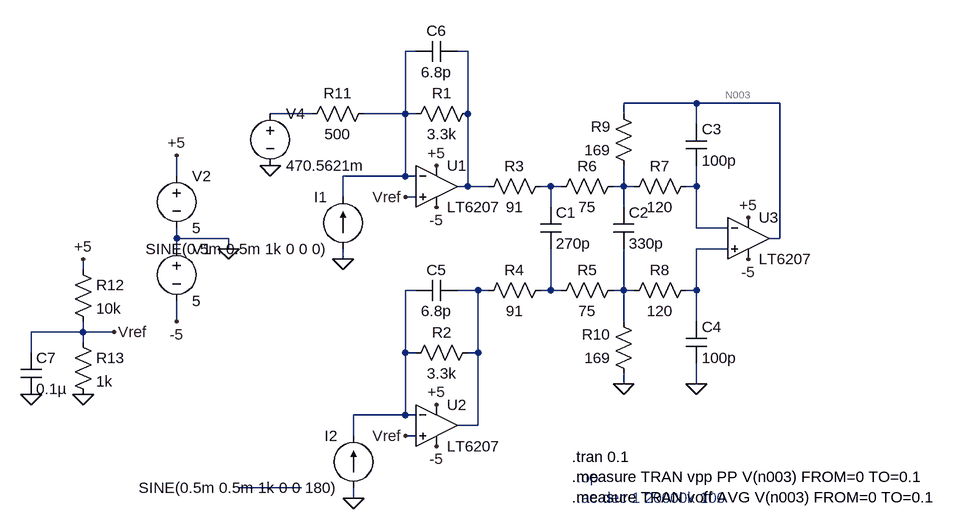
[diagram p0: schematic tsunami output stage.asc]
tsunami output stage.asc, the LTspice schematic file:
Version 4
SHEET 1 904 732
WIRE 112 16 96 16
WIRE 192 16 176 16
WIRE 544 96 432 96
WIRE 672 96 544 96
WIRE -48 112 -112 112
WIRE 96 112 96 16
WIRE 96 112 32 112
WIRE 112 112 96 112
WIRE 192 112 192 16
WIRE 432 112 432 96
WIRE 544 128 544 96
WIRE -256 208 -256 176
WIRE 96 208 96 112
WIRE 96 208 0 208
WIRE 112 208 96 208
WIRE 192 224 192 112
WIRE 192 224 176 224
WIRE 224 224 192 224
WIRE 320 224 304 224
WIRE 336 224 320 224
WIRE 432 224 432 192
WIRE 432 224 416 224
WIRE 448 224 432 224
WIRE 544 224 544 192
WIRE 544 224 528 224
WIRE 0 240 0 208
WIRE 112 240 96 240
WIRE 320 256 320 224
WIRE 432 256 432 224
WIRE 544 288 544 224
WIRE 592 288 544 288
WIRE -256 304 -256 288
WIRE -176 304 -256 304
WIRE 672 304 672 96
WIRE 672 304 656 304
WIRE -256 320 -256 304
WIRE -176 320 -176 304
WIRE 592 320 544 320
WIRE 0 336 0 320
WIRE -400 352 -400 336
WIRE 112 384 96 384
WIRE 208 384 176 384
WIRE 224 384 208 384
WIRE 320 384 320 320
WIRE 320 384 304 384
WIRE 336 384 320 384
WIRE 432 384 432 320
WIRE 432 384 416 384
WIRE 448 384 432 384
WIRE 544 384 544 320
WIRE 544 384 528 384
WIRE -256 432 -256 400
WIRE 432 432 432 384
WIRE 544 432 544 384
WIRE -400 448 -400 432
WIRE -400 448 -480 448
WIRE -352 448 -400 448
WIRE -400 464 -400 448
WIRE -480 480 -480 448
WIRE 96 480 96 384
WIRE 112 480 96 480
WIRE 208 480 208 384
WIRE 208 480 192 480
WIRE 432 528 432 512
WIRE 544 528 544 496
WIRE 96 576 96 480
WIRE 96 576 16 576
WIRE 112 576 96 576
WIRE 208 592 208 480
WIRE 208 592 176 592
WIRE 16 608 16 576
WIRE 112 608 96 608
WIRE -64 688 -160 688
WIRE 16 704 16 688
FLAG -256 176 +5
FLAG -256 432 -5
FLAG -176 320 0
FLAG 144 192 +5
FLAG 144 560 +5
FLAG 624 272 +5
FLAG 144 256 -5
FLAG 144 624 -5
FLAG 624 336 -5
FLAG 432 528 0
FLAG 544 528 0
FLAG 0 336 0
FLAG 16 704 0
FLAG -352 448 Vref
FLAG -400 544 0
FLAG 96 240 Vref
FLAG 96 608 Vref
FLAG -112 192 0
FLAG -400 336 +5
FLAG -480 544 0
SYMBOL voltage -256 304 R0
SYMATTR InstName V1
SYMATTR Value 5
SYMBOL voltage -256 192 R0
SYMATTR InstName V2
SYMATTR Value 5
SYMBOL Opamps/LT6207 144 224 R0
SYMATTR InstName U1
SYMBOL Opamps/LT6207 144 592 R0
SYMATTR InstName U2
SYMBOL Opamps/LT6207 624 304 R0
SYMATTR InstName U3
SYMBOL res 208 96 R90
WINDOW 0 0 56 VBottom 2
WINDOW 3 32 56 VTop 2
SYMATTR InstName R1
SYMATTR Value 3.3k
SYMBOL res 208 464 R90
WINDOW 0 0 56 VBottom 2
WINDOW 3 32 56 VTop 2
SYMATTR InstName R2
SYMATTR Value 3.3k
SYMBOL res 320 208 R90
WINDOW 0 0 56 VBottom 2
WINDOW 3 32 56 VTop 2
SYMATTR InstName R3
SYMATTR Value 91
SYMBOL res 320 368 R90
WINDOW 0 0 56 VBottom 2
WINDOW 3 32 56 VTop 2
SYMATTR InstName R4
SYMATTR Value 91
SYMBOL res 432 368 R90
WINDOW 0 0 56 VBottom 2
WINDOW 3 32 56 VTop 2
SYMATTR InstName R5
SYMATTR Value 75
SYMBOL res 432 208 R90
WINDOW 0 0 56 VBottom 2
WINDOW 3 32 56 VTop 2
SYMATTR InstName R6
SYMATTR Value 75
SYMBOL res 544 208 R90
WINDOW 0 0 56 VBottom 2
WINDOW 3 32 56 VTop 2
SYMATTR InstName R7
SYMATTR Value 120
SYMBOL res 544 368 R90
WINDOW 0 0 56 VBottom 2
WINDOW 3 32 56 VTop 2
SYMATTR InstName R8
SYMATTR Value 120
SYMBOL res 448 208 R180
WINDOW 0 36 76 Left 2
WINDOW 3 36 40 Left 2
SYMATTR InstName R9
SYMATTR Value 169
SYMBOL res 448 528 R180
WINDOW 0 36 76 Left 2
WINDOW 3 36 40 Left 2
SYMATTR InstName R10
SYMATTR Value 169
SYMBOL cap 304 256 R0
SYMATTR InstName C1
SYMATTR Value 270p
SYMBOL cap 416 256 R0
SYMATTR InstName C2
SYMATTR Value 330p
SYMBOL cap 528 128 R0
SYMATTR InstName C3
SYMATTR Value 100p
SYMBOL cap 528 432 R0
SYMATTR InstName C4
SYMATTR Value 100p
SYMBOL cap 176 368 R90
WINDOW 0 0 32 VBottom 2
WINDOW 3 32 32 VTop 2
SYMATTR InstName C5
SYMATTR Value 6.8p
SYMBOL cap 176 0 R90
WINDOW 0 0 32 VBottom 2
WINDOW 3 32 32 VTop 2
SYMATTR InstName C6
SYMATTR Value 6.8p
SYMBOL current 0 320 R180
WINDOW 0 24 80 Left 2
WINDOW 3 24 0 Left 2
SYMATTR InstName I1
SYMATTR Value SINE(0.5m 0.5m 1k 0 0 0)
SYMATTR Value2 AC 2m 0
SYMBOL current 16 688 R180
WINDOW 0 24 80 Left 2
WINDOW 3 24 0 Left 2
SYMATTR InstName I2
SYMATTR Value SINE(0.5m 0.5m 1k 0 0 180)
SYMATTR Value2 AC 2m 180
SYMBOL res -416 336 R0
SYMATTR InstName R12
SYMATTR Value 10k
SYMBOL res -416 448 R0
SYMATTR InstName R13
SYMATTR Value 1k
SYMBOL res 48 96 R90
WINDOW 0 0 56 VBottom 2
WINDOW 3 32 56 VTop 2
SYMATTR InstName R11
SYMATTR Value 500
SYMBOL voltage -112 96 R0
SYMATTR InstName V4
SYMATTR Value 470.5621m
SYMBOL cap -496 480 R0
SYMATTR InstName C7
SYMATTR Value 0.1µ
TEXT 360 672 Left 2 ;.op\n.ac dec 1 20000k 100
TEXT 352 640 Left 2 !.tran 0.1\n.measure TRAN vpp PP V(n003) FROM=0 TO=0.1\n.measure TRAN voff AVG V(n003) FROM=0 TO=0.1

The netlist it stands for:
* tsunami output stage.asc
V1 0 -5 5
V2 +5 0 5
XU1 Vref N001 N002 +5 -5 LT6205  ; LT6207, pins In+ In- OUT V+ V-
XU2 Vref N009 N010 +5 -5 LT6205  ; LT6207, pins In+ In- OUT V+ V-
XU3 N008 N007 N003 +5 -5 LT6205  ; LT6207, pins In+ In- OUT V+ V-
R1 N002 N001 3.3k
R2 N010 N009 3.3k
R3 N005 N002 91
R4 N011 N010 91
R5 N012 N011 75
R6 N006 N005 75
R7 N007 N006 120
R8 N008 N012 120
R9 N006 N003 169
R10 0 N012 169
C1 N005 N011 270p
C2 N006 N012 330p
C3 N003 N007 100p
C4 N008 0 100p
C5 N010 N009 6.8p
C6 N002 N001 6.8p
I1 0 N001 SINE(0.5m 0.5m 1k 0 0 0) AC 2m 0
I2 0 N009 SINE(0.5m 0.5m 1k 0 0 180) AC 2m 180
R12 +5 Vref 10k
R13 Vref 0 1k
R11 N001 N004 500
V4 N004 0 470.5621m
C7 Vref 0 0.1µ
* .op
* .ac dec 1 20000k 100
.tran 0.1
.measure TRAN vpp PP V(n003) FROM=0 TO=0.1
.measure TRAN voff AVG V(n003) FROM=0 TO=0.1
.lib LTC2.lib
.backanno
.end